# EAGLE design ps2 (EAGLE 9.6.1)
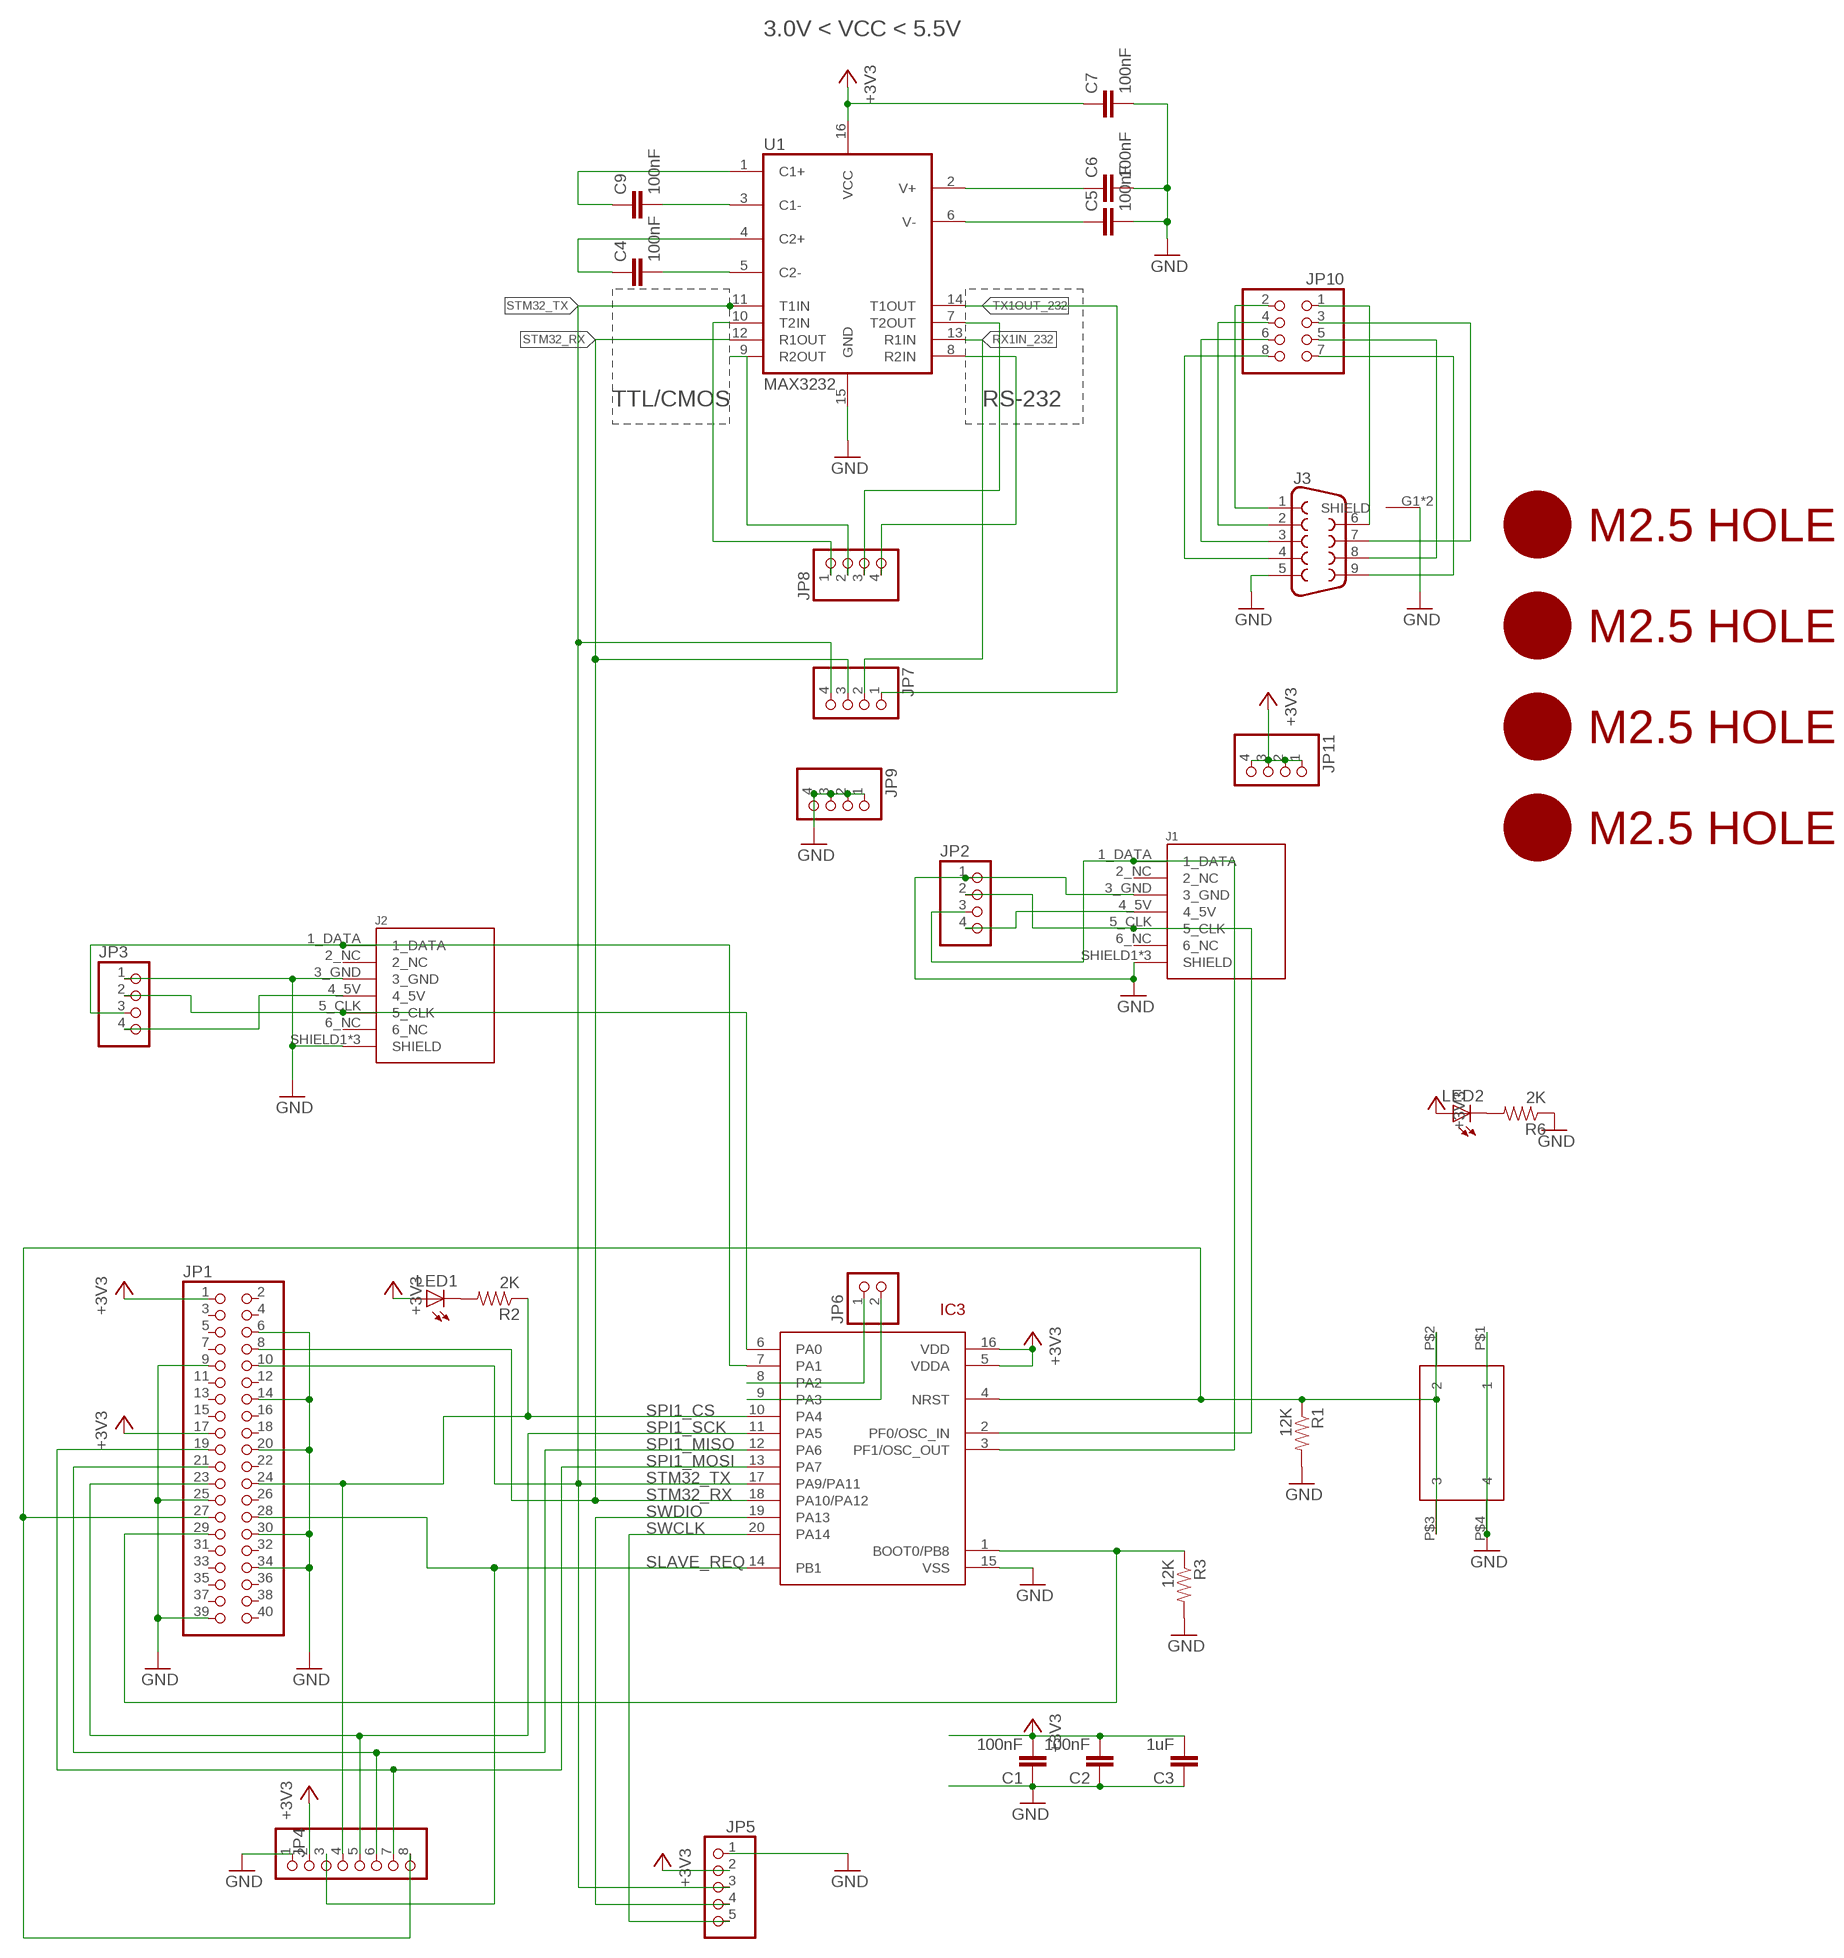
[diagram p0: schematic, sheet 1]

## Parts
C1  100nF  CAP0805  [0805@1]
C2  100nF  CAP0805  [0805@1]
C3  1uF  CAP0805  [0805@1]
C4  100nF  CAP0805  [0805@1]
C5  100nF  CAP0805  [0805@1]
C6  100nF  CAP0805  [0805@1]
C7  100nF  CAP0805  [0805@1]
C9  100nF  CAP0805  [0805@1]
IC3  STM32F042F4  [TSSOP20]
J1  DIN7  [DIN7]
J2  DIN7  [DIN7]
J3  DB9MALE  [DB9_MALE]
JP1  PINHD-2X20-BIG  [2X20-BIG]
JP2  PINHD-1X4  [1X04]
JP3  PINHD-1X4  [1X04]
JP4  PINHD-1X8  [1X08]
JP5  PINHD-1X5  [1X05]
JP6  PINHD-1X2  [1X02]
JP7  PINHD-1X4  [1X04]
JP8  PINHD-1X4  [1X04]
JP9  PINHD-1X4  [1X04]
JP10  PINHD-2X4  [2X04]
JP11  PINHD-1X4  [1X04]
LED1  LEDCHIP-LED0805  [CHIP-LED0805]
LED2  LEDCHIP-LED0805  [CHIP-LED0805]
R1  12K  RESISTOR0805-RES  [0805]
R2  2K  RESISTOR0805-RES  [0805]
R3  12K  RESISTOR0805-RES  [0805]
R6  2K  RESISTOR0805-RES  [0805]
SW4  324_SW  [342_SWICH_FOOT]
U1  MAX3232  MAX232SOIC16  [SO016]
U$2  M2.5HOLE  [M2.5HOLE]
U$3  M2.5HOLE  [M2.5HOLE]
U$4  M2.5HOLE  [M2.5HOLE]
U$5  M2.5HOLE  [M2.5HOLE]

## Nets
+3V3: C1.2 C2.2 C3.2 C7.1 IC3.5(VDDA) IC3.16(VDD) JP1.1 JP1.17 JP4.2 JP5.2 JP11.1 JP11.2 JP11.3 JP11.4 LED1.A LED2.A U1.16(VCC)
C1+: C9.1 U1.1(C1+)
C1-: C9.2 U1.3(C1-)
C2+: C4.1 U1.4(C2+)
C2-: C4.2 U1.5(C2-)
GND: C1.1 C2.1 C3.1 C5.2 C6.2 C7.2 IC3.15(VSS) J1.3_GND J1.SHIELD1(SHIELD) J1.SHIELD2(SHIELD) J1.SHIELD3(SHIELD) J2.3_GND J2.SHIELD1(SHIELD) J2.SHIELD2(SHIELD) J2.SHIELD3(SHIELD) J3.5 J3.G1(SHIELD) J3.G2(SHIELD) JP1.6 JP1.9 JP1.14 JP1.20 JP1.25 JP1.30 JP1.34 JP1.39 JP2.1 JP3.1 JP4.1 JP5.1 JP9.1 JP9.2 JP9.3 JP9.4 R1.2 R3.2 R6.1 SW4.P$1 SW4.P$4 U1.15(GND)
N$1: IC3.4(NRST) JP1.27 JP4.8 R1.1 SW4.P$2 SW4.P$3
N$2: LED1.C R2.2
N$3: J1.4_5V JP2.4
N$4: J2.4_5V JP3.4
N$5: IC3.2(PF0/OSC_IN) J1.5_CLK JP2.2
N$6: IC3.3(PF1/OSC_OUT) J1.1_DATA JP2.3
N$7: IC3.6(PA0) J2.5_CLK JP3.2
N$8: IC3.7(PA1) J2.1_DATA JP3.3
N$9: IC3.1(BOOT0/PB8) JP1.29 R3.1
N$10: IC3.8(PA2) JP6.1
N$11: IC3.9(PA3) JP6.2
N$12: JP8.1 U1.10(T2IN)
N$13: JP8.2 U1.9(R2OUT)
N$14: JP8.3 U1.7(T2OUT)
N$15: JP8.4 U1.8(R2IN)
N$16: J3.1 JP10.2
N$17: J3.2 JP10.4
N$18: J3.3 JP10.6
N$19: J3.4 JP10.8
N$20: J3.6 JP10.1
N$21: J3.7 JP10.3
N$22: J3.8 JP10.5
N$23: J3.9 JP10.7
N$29: LED2.C R6.2
RX1IN_232: JP7.2 U1.13(R1IN)
SLAVE_REQ: IC3.14(PB1) JP1.28 JP4.3
SPI1_CS: IC3.10(PA4) JP1.24 JP4.4 R2.1
SPI1_MISO: IC3.12(PA6) JP1.21 JP4.6
SPI1_MOSI: IC3.13(PA7) JP1.19 JP4.7
SPI1_SCK: IC3.11(PA5) JP1.23 JP4.5
STM32_RX: IC3.18(PA10/PA12) JP1.8 JP7.3 U1.12(R1OUT)
STM32_TX: IC3.17(PA9/PA11) JP1.10 JP5.3 JP7.4 U1.11(T1IN)
SWCLK: IC3.20(PA14) JP5.5
SWDIO: IC3.19(PA13) JP5.4
TX1OUT_232: JP7.1 U1.14(T1OUT)
V+: C6.1 U1.2(V+)
V-: C5.1 U1.6(V-)
Unconnected: J1.2_NC J1.6_NC J2.2_NC J2.6_NC JP1.2 JP1.3 JP1.4 JP1.5 JP1.7 JP1.11 JP1.12 JP1.13 JP1.15 JP1.16 JP1.18 JP1.22 JP1.26 JP1.31 JP1.32 JP1.33 JP1.35 JP1.36 JP1.37 JP1.38 JP1.40

## Notes on the sheet
- 3.0V < VCC < 5.5V
- TTL/CMOS | RS-232

## Library data of the parts
C1-C7 C9 = clock:CAP: Capacitor Standard 0603 ceramic capacitor, and 0.1" leaded capacitor.
IC3 = tx:STM32F042F4
J1 J2 = SparkFun-Connectors:DIN7: Mini-DIN7 Connector Through-hole MiniDIN 7 connector. Commonly used with Roomba products. Don't confuse this with DIN-6, which is commonly used on oldschool keyboards and mice. Here is the female version connector we sell at SparkFun: MiniDIN 7-Pin Connector <https://www.sparkfun.com/products/696> (PRT-00696); PROD_ID: CONN-08318; SF_ID: PRT-00696
J3 = SparkFun-Connectors:DB9: DB9 Connector Standard DB9 (D-Sub 9) serial connector. Can be used for CAN bus as well as RS485 and RS232. Footprint production proven. Here is the female version connector we sell at SparkFun: 9 Pin Female Serial Connector - PCB Mount <https://www.sparkfun.com/products/429> (PRT-00429) This connector has been used on the following SparkFun products: SparkFun RS232 Shifter - SMD <https://www.sparkfun.com/products/449> (PRT-00449) SparkFun RS232 Shifter SMD (No DB9) <https://www.sparkfun.com/products/8780> (PRT-08780); PROD_ID: CONN-09904
JP1 = adafruit_changed:PINHD-2X20: PIN HEADER
JP2 JP3 JP7-JP9 JP11 = pinhead:PINHD-1X4: PIN HEADER
JP4 = pinhead:PINHD-1X8: PIN HEADER
JP5 = pinhead:PINHD-1X5: PIN HEADER
JP6 = pinhead:PINHD-1X2: PIN HEADER
JP10 = pinhead:PINHD-2X4: PIN HEADER
LED1 LED2 = adafruit:LED: LED OSRAM: - CHIPLED LG R971, LG N971, LY N971, LG Q971, LY Q971, LO R971, LY R971 LH N974, LH R974 LS Q976, LO Q976, LY Q976 LO Q996 - Hyper CHIPLED LW Q18S LB Q993, LB Q99A, LB R99A - SideLED LS A670, LO A670, LY A670, LG A670, LP A670 LB A673, LV A673, LT A673, LW A673 LH A674 LY A675 LS A676, LA A676, LO A676, LY A676, LW A676 LS A679, LY A679, LG A679 - Hyper Micro SIDELED® LS Y876, LA Y876, LO Y876, LY Y876 LT Y87S - SmartLED LW L88C, LW L88S LB L89C, LB L89S, LG L890 LS L89K, LO L89K, LY L89K LS L896, LA L896, LO L896, LY L896 - TOPLED LS T670, LO T670, LY T670, LG T670, LP T670 LSG T670, LSP T670, LSY T670, LOP T670, LYG T670 LG T671, LOG T671, LSG T671 LB T673, LV T673, LT T673, LW T673 LH T674 LS T676, LA T676, LO T676, LY T676, LB T676, LH T676, LSB T676, LW T676 LB T67C, LV T67C, LT T67C, LS T67K, LO T67K, LY T67K, LW E67C LS E67B, LA E67B, LO E67B, LY E67B, LB E67C, LV E67C, LT E67C LW T67C LS T679, LY T679, LG T679 LS T770, LO T770, LY T770, LG T770, LP T770 LB T773, LV T773, LT T773, LW T773 LH T774 LS E675, LA E675, LY E675, LS T675 LS T776, LA T776, LO T776, LY T776, LB T776 LHGB T686 LT T68C, LB T68C - Hyper Mini TOPLED® LB M676 - Mini TOPLED Santana® LG M470 LS M47K, LO M47K, LY M47K Source: http://www.osram.convergy.de/
R1-R3 R6 = SparkFun-Passives:RESISTOR: Resistor Basic schematic elements and footprints for 0603, 1206, and PTH resistors.
SW4 = 3pos_slide_switch_centered:324_SW
U1 = SparkFun-DigitalIC:MAX232: RS232 Transceiver Very common IC. This is generically called 'MAX232', but works with the 3V equivalent MAX3232 generic ICs. Field tested and mother approved. Spark Fun Electronics SKU : COM-00316 (DIP) and COM-00589 (SMD); PROD_ID: IC-08171
U$2-U$5 = f1c100s:M2.5HOLE

## Net classes
1 power: width 0.178 mm

## Board
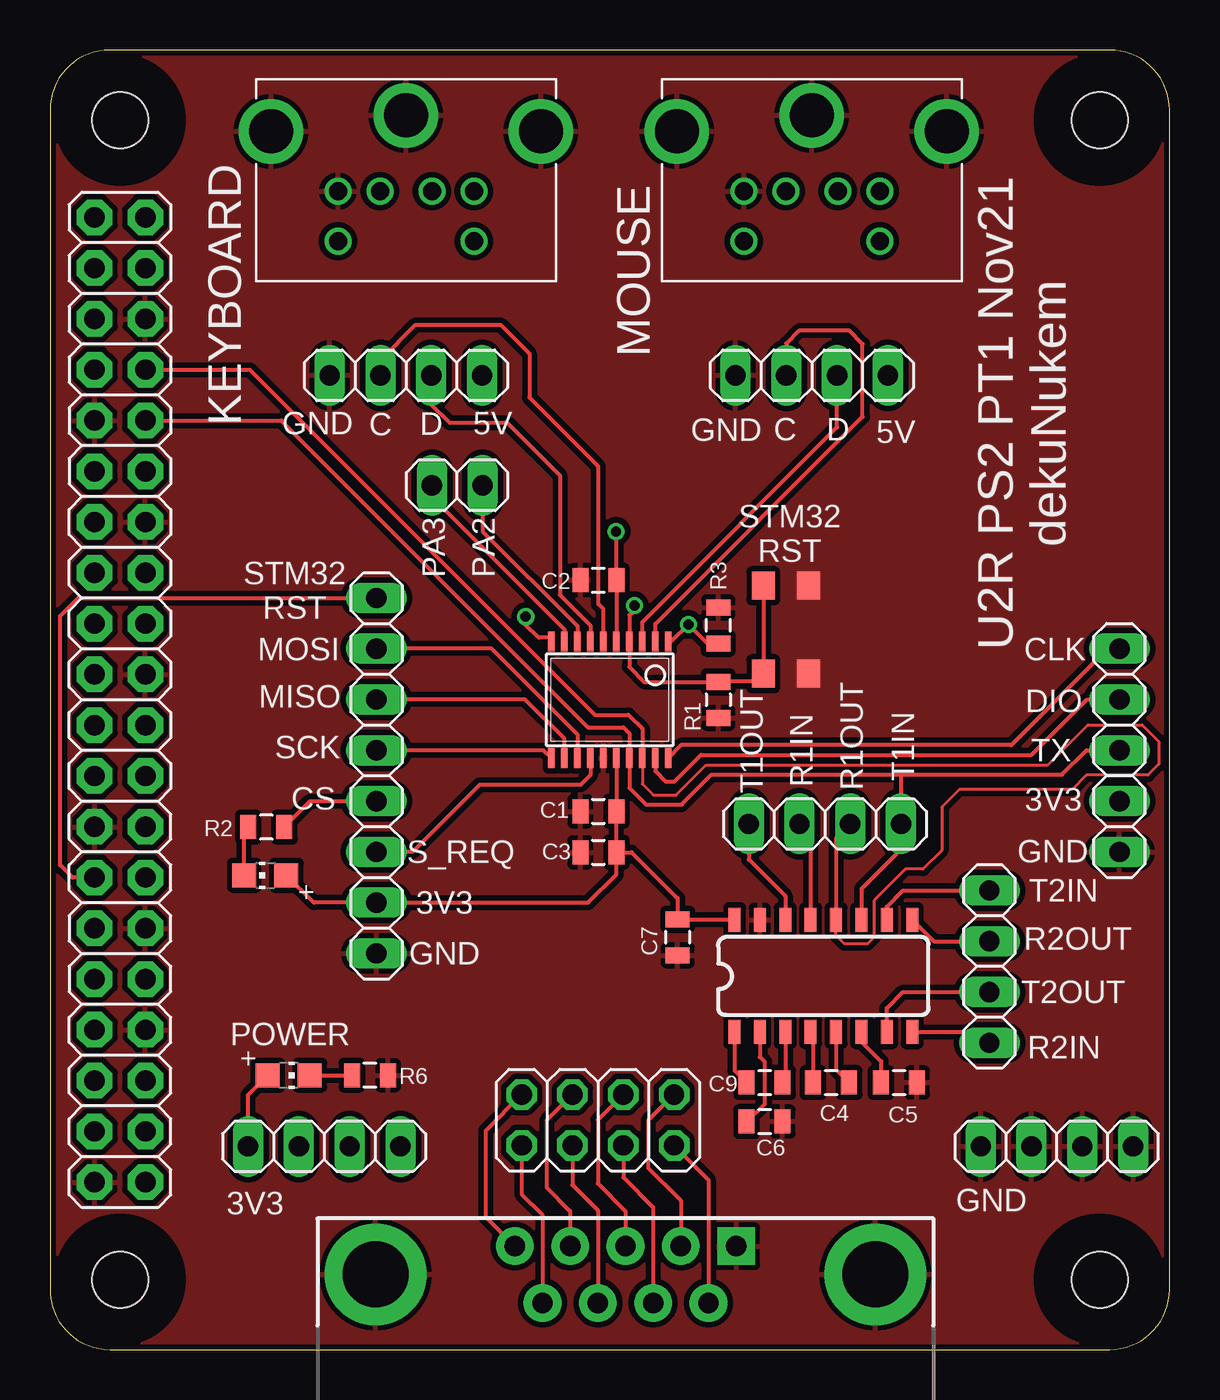
[diagram p1: board, top side]
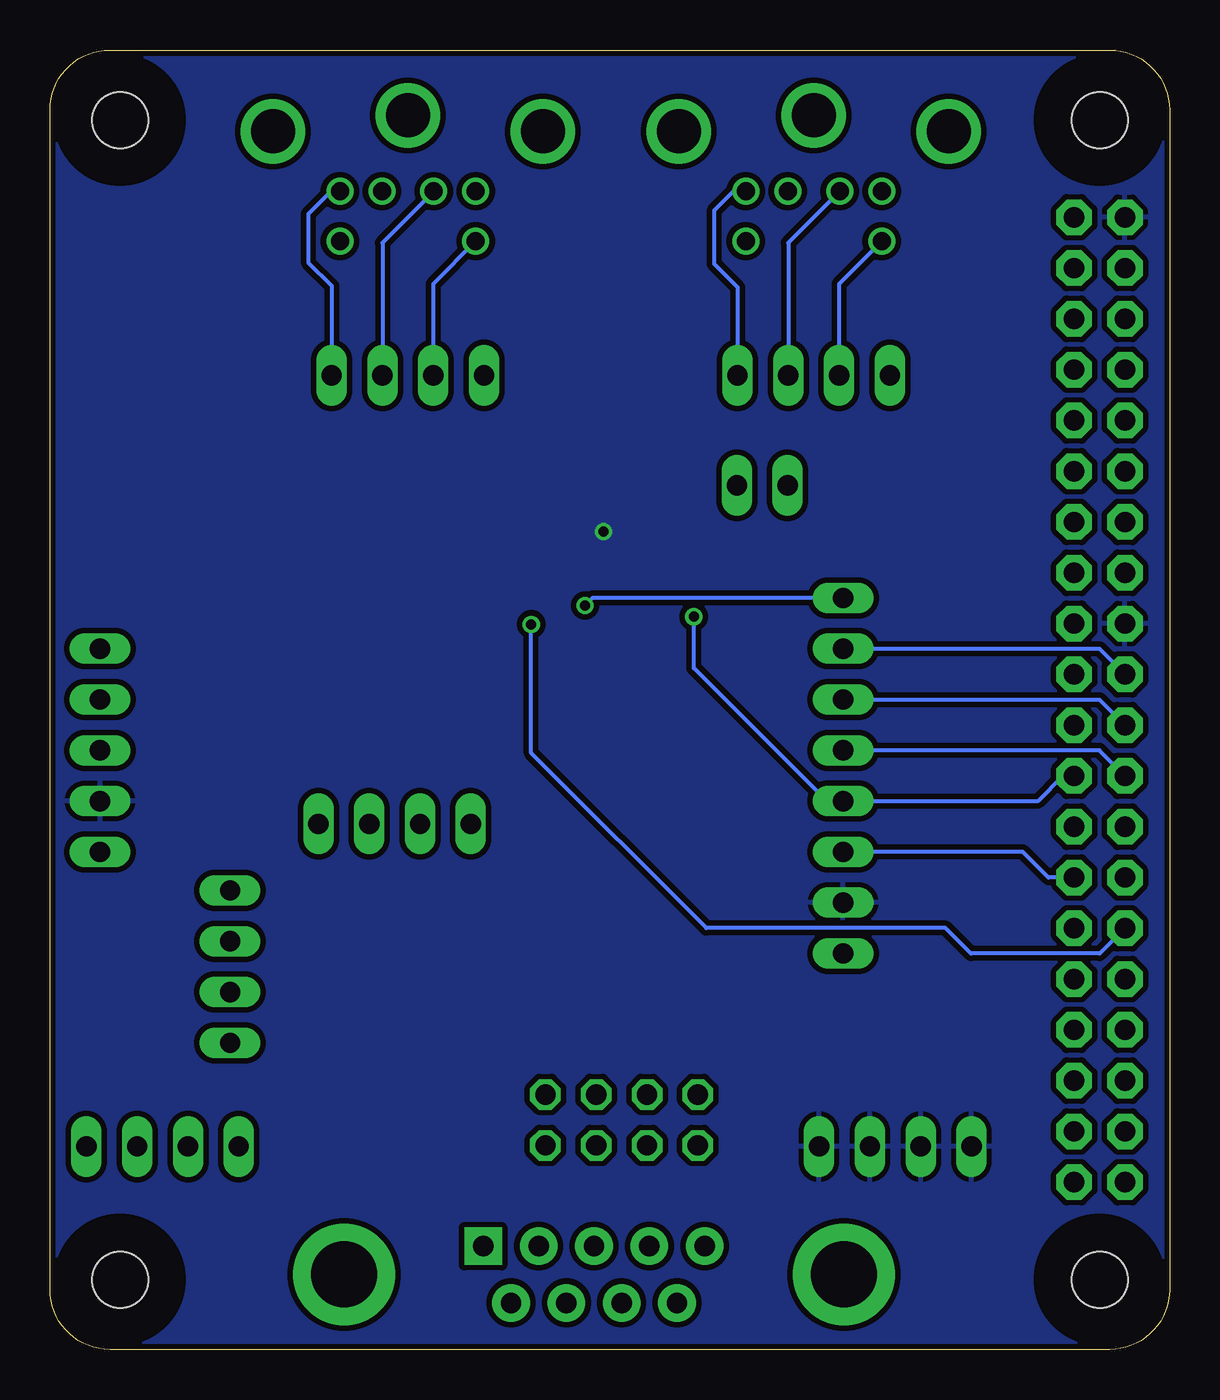
[diagram p2: board, bottom side, seen from below]

Size 56 x 65 mm. Coordinates in mm from the lower left corner, seen from the top.
Outline: 3,0 53,0 arc90 56,3 56,62 arc90 53,65 3,65 arc90 0,62 0,3 arc90 3,0
Copper layers (1*16): Top 0.035mm / dielectric 1.5mm / Bottom 0.035mm
Design rules "deku_2layer_6mil": minimum track width 6mil, minimum drill 15mil, track to track 6mil, track to pad 6mil, pad to pad 6mil, via to via 6mil, smd to smd 6mil, copper to edge 10mil, drill to drill 6mil, minimum pad ring 7mil, minimum via ring 7mil, stop-mask expansion 4mil, vias tented up to drill 25mil, thermal gap 10mil

### Footprints (pad centres in the part's own frame; a part is rotated, then mirrored left to right if it is on the bottom)
0805@1 = smd 0.8 x 1.2: 1 -0.9,0; 2 0.9,0
TSSOP20 = smd 0.305 x 0.991: 1 -2.925,-2.918; 2 -2.275,-2.918; 3 -1.625,-2.918; 4 -0.975,-2.918; 5 -0.325,-2.918; 6 0.325,-2.918; 7 0.975,-2.918; 8 1.625,-2.918; 9 2.275,-2.918; 10 2.925,-2.918; 11 2.925,2.918; 12 2.275,2.918; 13 1.625,2.918; 14 0.975,2.918; 15 0.325,2.918; 16 -0.325,2.918; 17 -0.975,2.918; 18 -1.625,2.918; 19 -2.275,2.918; 20 -2.925,2.918
DIN7 = drill 0.9: 1_DATA -1.3,-3.8; 2_NC 1.3,-3.8; 3_GND -3.4,-3.8; 4_5V 3.4,-3.8; 5_CLK -3.4,-6.3; 6_NC 3.4,-6.3 | drill 2.2: SHIELD1 -6.75,-0.8; SHIELD2 0,0; SHIELD3 6.75,-0.8
DB9_MALE = drill 1.016 pad 1.88: 1 5.54,-1.42; 2 2.77,-1.42; 3 0,-1.42; 4 -2.77,-1.42; 6 4.15,1.42; 7 1.38,1.42; 8 -1.38,1.42; 9 -4.15,1.42 | drill 1.016 pad 1.88 square: 5 -5.54,-1.42 | drill 3.302 pad 5.08: G1 -12.5,0; G2 12.5,0
2X20-BIG = drill 1.016 pad 1.778 octagon: 1 -24.13,-1.27; 2 -24.13,1.27; 3 -21.59,-1.27; 4 -21.59,1.27; 5 -19.05,-1.27; 6 -19.05,1.27; 7 -16.51,-1.27; 8 -16.51,1.27; 9 -13.97,-1.27; 10 -13.97,1.27; 11 -11.43,-1.27; 12 -11.43,1.27; 13 -8.89,-1.27; 14 -8.89,1.27; 15 -6.35,-1.27; 16 -6.35,1.27; 17 -3.81,-1.27; 18 -3.81,1.27; 19 -1.27,-1.27; 20 -1.27,1.27; 21 1.27,-1.27; 22 1.27,1.27; 23 3.81,-1.27; 24 3.81,1.27; 25 6.35,-1.27; 26 6.35,1.27; 27 8.89,-1.27; 28 8.89,1.27; 29 11.43,-1.27; 30 11.43,1.27; 31 13.97,-1.27; 32 13.97,1.27; 33 16.51,-1.27; 34 16.51,1.27; 35 19.05,-1.27; 36 19.05,1.27; 37 21.59,-1.27; 38 21.59,1.27; 39 24.13,-1.27; 40 24.13,1.27
1X04 = drill 1.016 long: 1 -3.81,0; 2 -1.27,0; 3 1.27,0; 4 3.81,0
1X08 = drill 1.016 long: 1 -8.89,0; 2 -6.35,0; 3 -3.81,0; 4 -1.27,0; 5 1.27,0; 6 3.81,0; 7 6.35,0; 8 8.89,0
1X05 = drill 1.016 long: 1 -5.08,0; 2 -2.54,0; 3 0,0; 4 2.54,0; 5 5.08,0
1X02 = drill 1.016 long: 1 -1.27,0; 2 1.27,0
2X04 = drill 1.016 octagon: 1 -3.81,-1.27; 2 -3.81,1.27; 3 -1.27,-1.27; 4 -1.27,1.27; 5 1.27,-1.27; 6 1.27,1.27; 7 3.81,-1.27; 8 3.81,1.27
CHIP-LED0805 = smd 1.2 x 1.2: A 0,-1.05; C 0,1.05
0805 = smd 0.8 x 1.2: 1 -0.9,0; 2 0.9,0
342_SWICH_FOOT = smd 1.4 x 1.15: P$1 -2.2,-1.125; P$2 -2.2,1.125; P$3 2.2,1.125; P$4 2.2,-1.125
SO016 = smd 0.6 x 1.2: 1 -4.445,-2.8; 2 -3.175,-2.8; 3 -1.905,-2.8; 4 -0.635,-2.8; 5 0.635,-2.8; 6 1.905,-2.8; 7 3.175,-2.8; 8 4.445,-2.8; 9 4.445,2.8; 10 3.175,2.8; 11 1.905,2.8; 12 0.635,2.8; 13 -0.635,2.8; 14 -1.905,2.8; 15 -3.175,2.8; 16 -4.445,2.8
M2.5HOLE = hole 2.8: 0,0

### Placement (x,y rotation side)
C1  27.43,26.92 0 top
C2  27.43,38.48 0 top
C3  27.43,24.87 0 top
C4  39.07,13.36 0 top
C5  42.47,13.36 0 top
C6  35.74,11.4 0 top
C7  31.39,20.62 270 top
C9  35.74,13.36 0 top
IC3  28,32.5 180 top
J1  38.1,61.73 0 top
J2  17.8,61.73 0 top
J3  28.79,3.75 180 top
JP1  3.5,32.5 270 top
JP2  38.1,48.73 0 top
JP3  17.8,48.73 0 top
JP4  16.33,28.7 90 top
JP5  53.49,29.97 90 top
JP6  20.37,43.23 180 top
JP7  38.76,26.29 0 top
JP8  46.99,19.15 270 top
JP9  50.37,10.16 180 top
JP10  27.41,11.48 0 top
JP11  13.72,10.16 0 top
LED1  10.77,23.72 90 top
LED2  11.94,13.72 270 top
R1  33.43,32.5 270 top
R2  10.82,26.14 180 top
R3  33.43,36.22 90 top
R6  16,13.72 180 top
SW4  36.8,36.01 90 top
U1  38.68,18.69 0 top
U$2  3.5,3.5 0 top
U$3  52.5,3.5 0 top
U$4  3.5,61.5 0 top
U$5  52.5,61.5 0 top

### Tracks (layer width: path | path; a pad name or v marks a point on that pad's centre or on a via)
+3V3  (via drill 0.5)
  Top 0.203: LED1.A 13.19,22.35 JP4.2 26.92,22.35 28.33,23.76 C3.2 | v28.32,40.92 28.32,38.49 C2.2 28.33,35.42 IC3.5 | C3.2 C1.2 28.33,29.57 IC3.16 | U1.16 34.21,21.52 C7.1 31.39,22.57 29.09,24.87 C3.2 | JP11.1 9.91,12.73 LED2.A
  pour Bottom (isolate 0.279, rank 2): 0,3 0,62 arc-90 3,65 53,65 arc-90 56,62 56,3 arc-90 53,0 3,0 arc-90
C1+
  Top 0.203: U1.1 34.24,13.96 C9.1
C1-
  Top 0.203: U1.3 36.78,13.5 C9.2
C2+
  Top 0.203: U1.4 38.16,15.78 C4.1
C2-
  Top 0.203: U1.5 39.32,14.01 C4.2
GND
  pour Top (isolate 0.279): 3,0 53,0 arc90 56,3 56,62 arc90 53,65 3,65 arc90 0,62 0,3 arc90
N$1  (via drill 0.5)
  Top 0.203: SW4.P$3 SW4.P$2 35.68,33.4 R1.1 29.72,33.4 28.98,34.14 IC3.4 28.98,36.72 29.23,36.98 v29.23,37.21 | JP1.27 1.13,23.61 0.51,24.23 0.51,36.68 1.42,37.59 JP4.8 | v29.23,37.21
  Bottom 0.203: JP4.8 28.85,37.59 v29.23,37.21
N$2
  Top 0.203: LED1.C 9.72,25.94 R2.2
N$3
  Bottom 0.203: J1.4_5V 41.94,57.93 43.08,56.79 43.08,54.37 41.91,53.2 JP2.4
N$4
  Bottom 0.203: J2.4_5V 21.81,57.93 22.78,56.96 22.78,54.3 21.61,53.13 JP3.4
N$5
  Top 0.203: JP2.2 36.83,50.32 37.47,50.95 39.98,50.95 40.64,50.29 40.64,46.66 30.27,36.3 IC3.2
  Bottom 0.203: J1.5_CLK 36.83,53.3 JP2.2
N$6
  Top 0.203: JP2.3 39.37,46.13 29.62,36.38 IC3.3
  Bottom 0.203: J1.1_DATA 39.37,55.36 JP2.3
N$7
  Top 0.203: IC3.6 27.68,37.04 27.43,37.29 27.43,44.17 23.98,47.62 23.98,49.81 22.53,51.26 18.29,51.26 16.53,49.5 JP3.2
  Bottom 0.203: J2.5_CLK 16.53,53.3 JP3.2
N$8
  Top 0.203: IC3.7 27.02,36.22 25.5,37.74 25.5,43.71 22.86,46.35 19.99,46.35 19.07,47.27 JP3.3
  Bottom 0.203: J2.1_DATA 19.07,55.36 JP3.3
N$9  (via drill 0.5)
  Top 0.203: R3.1 32.88,35.32 v31.93,36.27 31.07,35.42 IC3.1
  Bottom 0.203: JP1.29 3.49,19.81 9.93,19.81 11.2,21.08 23.16,21.08 31.93,29.84 v31.93,36.27
N$10
  Top 0.203: JP6.1 21.64,40.92 26.38,36.19 IC3.8
N$11
  Top 0.203: IC3.9 25.73,36.02 19.1,42.65 JP6.2
N$12
  Top 0.203: U1.10 41.86,22.15 42.67,22.96 JP8.1
N$13
  Top 0.203: U1.9 44.2,20.42 JP8.2
N$14
  Top 0.203: U1.7 41.86,17.07 42.67,17.88 JP8.3
N$15
  Top 0.203: U1.8 46.44,15.89 JP8.4
N$16
  Top 0.203: JP10.2 21.79,10.95 21.79,6.63 J3.1
N$17
  Top 0.203: JP10.4 24.84,11.46 24.84,8.1 26.02,6.92 J3.2
N$18
  Top 0.203: JP10.6 27.41,11.48 27.41,8.3 28.79,6.92 J3.3
N$19
  Top 0.203: JP10.8 29.92,11.46 29.92,9.09 31.56,7.46 J3.4
N$20
  Top 0.203: JP10.1 23.6,7.77 24.64,6.73 J3.6
N$21
  Top 0.203: JP10.3 26.14,8.23 27.41,6.96 J3.7
N$22
  Top 0.203: JP10.5 28.68,8.61 30.17,7.12 J3.8
N$23
  Top 0.203: JP10.7 32.94,8.49 J3.9
N$29
  Top 0.203: LED2.C R6.2
RX1IN_232
  Top 0.203: JP7.2 38.05,25.73 U1.13
SLAVE_REQ
  Top 0.203: IC3.14 27.02,28.73 26.54,28.25 21.49,28.25 18.14,24.89 JP4.3
  Bottom 0.203: JP1.28 6.06,23.61 7.34,24.89 JP4.3
SPI1_CS  (via drill 0.5)
  Top 0.203: IC3.10 25.07,35.61 24.44,35.61 23.8,36.25 v23.8,36.65 | R2.1 13.02,27.43 JP4.4
  Bottom 0.203: JP1.24 5.33,28.69 6.6,27.42 JP4.4 17.14,27.43 23.8,34.09 v23.8,36.65
SPI1_MISO
  Top 0.203: IC3.12 25.73,30.56 23.77,32.51 JP4.6
  Bottom 0.203: JP4.6 3.51,32.51 JP1.21
SPI1_MOSI
  Top 0.203: IC3.13 26.38,30.77 22.1,35.05 JP4.7
  Bottom 0.203: JP4.7 3.51,35.05 JP1.19
SPI1_SCK
  Top 0.203: IC3.11 24.68,29.97 JP4.5
  Bottom 0.203: JP1.23 3.51,29.97 JP4.5
STM32_RX
  Top 0.152: U1.12 39.32,20.7 39.73,20.3 40.89,20.3 41.22,20.62 41.22,22.45 42.8,24.03 43.66,24.03 44.6,24.97 44.6,27.13 45.49,28.02 51.13,28.02 51.84,28.73 54.91,28.73 55.47,29.29 55.47,30.4 54.63,31.24 51.92,31.24 49.91,29.23 32.82,29.23 31.32,27.74 30.18,27.74 29.62,28.29 IC3.18
  Top 0.203: JP1.8 9.99,49.01 27.25,31.75 28.93,31.75 29.62,31.06 IC3.18 | JP7.3 39.32,25.58 U1.12
STM32_TX
  Top 0.203: JP1.10 11.57,46.47 26.92,31.11 28.68,31.11 28.98,30.82 IC3.17 28.98,28.1 29.82,27.25 31.6,27.25 33.1,28.75 42.57,28.75 | JP5.3 51.84,29.97 50.62,28.75 42.57,28.75 | U1.11 40.59,23.04 42.57,25.02 JP7.4 42.57,28.75
SWCLK
  Top 0.203: IC3.20 31.57,30.23 48.08,30.23 52.91,35.05 JP5.5
SWDIO
  Top 0.203: IC3.19 30.27,28.93 30.79,28.42 31.24,28.42 32.56,29.74 49.1,29.74 51.87,32.51 JP5.4
TX1OUT_232
  Top 0.203: JP7.1 34.95,24.51 36.78,22.68 U1.14
V+
  Top 0.203: U1.2 35.51,14.63 35.74,14.4 35.74,12.27 34.87,11.4 C6.1
V-
  Top 0.203: U1.6 40.59,15.39 41.57,14.41 C5.1

### Text on the board
tNames: MOUSE | KEYBOARD | U2R PS2 PT1 Nov21 / dekuNukem | GND | C | D | 5V | GND | C | D | 5V | STM32 / RST | PA3 | PA2 | STM32 / RST | MOSI | CLK | MISO | DIO | R1OUT | SCK | T1OUT | R1IN | T1IN | TX | CS | 3V3 | S_REQ | GND | T2IN | 3V3 | R2OUT | GND | T2OUT | POWER | R2IN | 3V3 | GND